# Altium schematic sheet Sheet3.SchDoc
size A; SheetNumber: 1; SheetTotal: 1
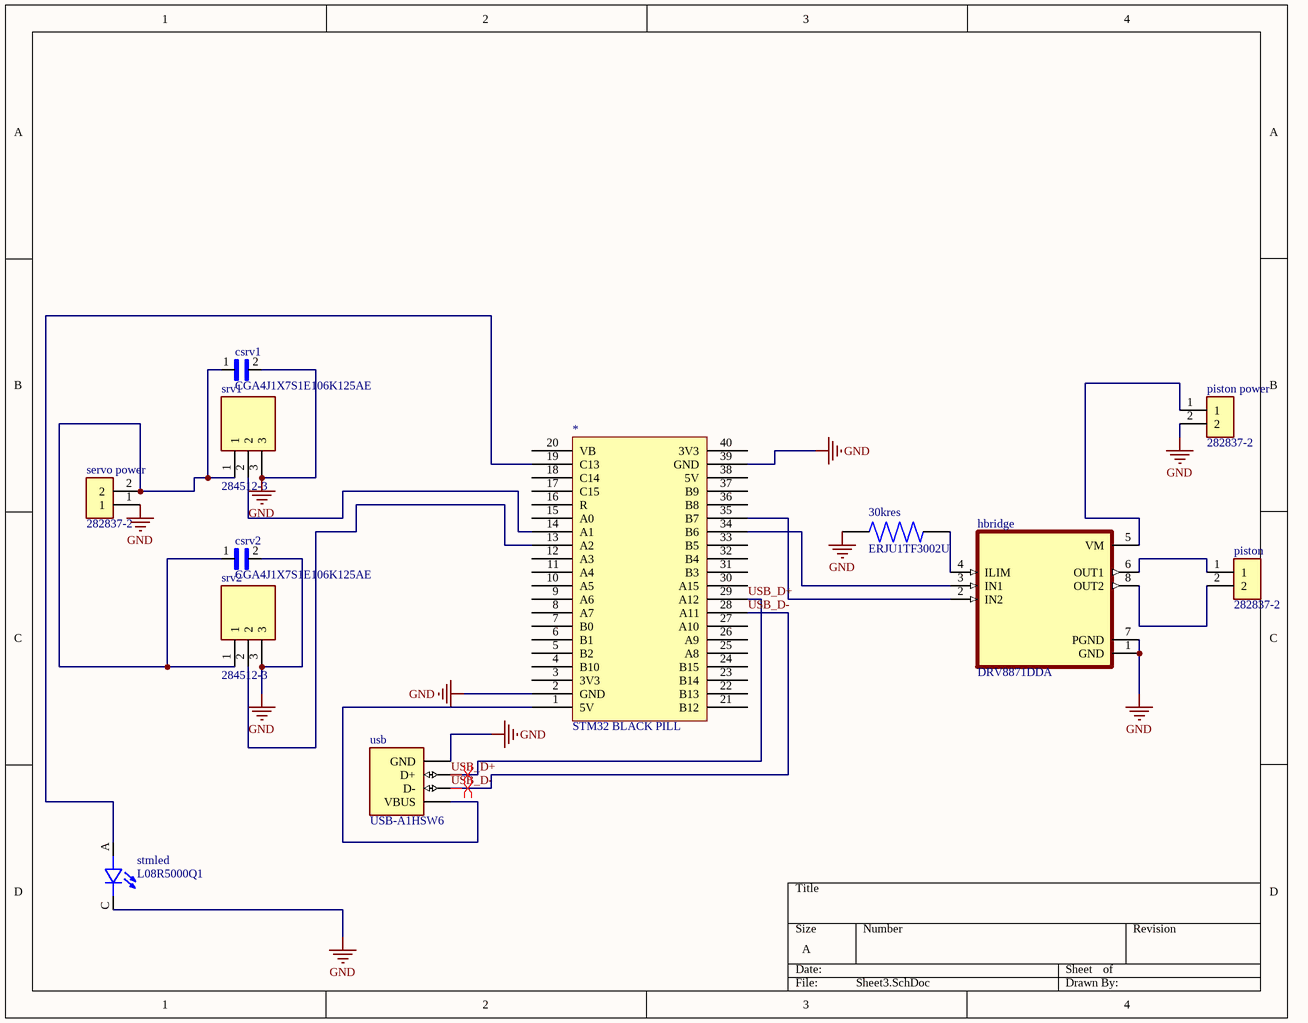
[diagram p0: Sheet3.SchDoc]

## Parts
30kres  ERJU1TF3002U  [RES_ERJU1TF3002U]
*  STM32 BLACK PILL  [STM 32 Black Pill]
csrv1  CGA4J1X7S1E106K125AE  [CAPC2012X150N]
csrv2  CGA4J1X7S1E106K125AE  [CAPC2012X150N]
hbridge  DRV8871DDA  [VREG_LM5017MR/NOPB]
piston  282837-2  [TE_282837-2]
piston_power  282837-2  [TE_282837-2]
servo_power  282837-2  [TE_282837-2]
srv1  284512-3  [TE_284512-3]
srv2  284512-3  [TE_284512-3]
stmled  L08R5000Q1  [LEDRD254W57D500H1070]
usb  USB-A1HSW6  [OST_USB-A1HSW6]

## Nets
GND: 30kres.1 *.2(GND) *.39(GND) csrv1.2 csrv2.2 hbridge.1(GND) hbridge.7(PGND) piston_power.2 servo_power.1 srv1.3 srv2.3 stmled.C usb.4(GND)
USB_D+: *.29(A12) usb.3(D+)
USB_D-: *.28(A11) usb.2(D-)
Net30kres_2: 30kres.2 hbridge.4(ILIM)
Net*_1: *.1(5V) usb.1(VBUS)
Net*_13: *.13(A2) srv2.2
Net*_14: *.14(A1) srv1.2
Net*_19: *.19(C13) stmled.A
Net*_34: *.34(B6) hbridge.3(IN1)
Net*_35: *.35(B7) hbridge.2(IN2)
Netcsrv1_1: csrv1.1 csrv2.1 servo_power.2 srv1.1 srv2.1
Nethbridge_5: hbridge.5(VM) piston_power.1
Nethbridge_6: hbridge.6(OUT1) piston.1
Nethbridge_8: hbridge.8(OUT2) piston.2

Not connected (* = marked no-connect by the designer): * 3(3V3) 4(B10) 5(B2) 6(B1) 7(B0) 8(A7) 9(A6) 10(A5) 11(A4) 12(A3) 15(A0) 16(R) 17(C15) 18(C14) 20(VB) 21(B12) 22(B13) 23(B14) 24(B15) 25(A8) 26(A9) 27(A10) 30(A15) 31(B3) 32(B4) 33(B5) 36(B8) 37(B9) 38(5V) 40(3V3)

## Layout directives
differential pair: USB_D+, USB_D-

## Library data of the parts
* = CMP-004-000000-1: Design Item ID: STM32 BLACK PILL; Source: STM 32 Balck Pill.SchLib
csrv1 csrv2 = CGA4J1X7S1E106K125AE: 10 ÂµF Â±10% 25V Ceramic Capacitor X7S 0805 (2012 Metric); MF: TDK; Value: *; Package: 2012 TDK; Check_prices: https://www.snapeda.com/parts/CGA4J1X7S1E106K125AE/TDK/view-part/?ref=eda; Digi-Key_Part_Number: 445-181411-2-ND; Purchase-URL: https://pricing.snapeda.com/search/part/CGA4J1X7S1E106K125AE/?ref=eda; SnapEDA_Link: https://www.snapeda.com/parts/CGA4J1X7S1E106K125AE/TDK/view-part/?ref=snap; MP: CGA4J1X7S1E106K125AE
hbridge = DRV8871DDA: 50-V, 3.6-A H-bridge motor driver with integrated current sensing; MF: Texas Instruments; SnapEDA_Link: https://www.snapeda.com/parts/DRV8871DDA/Texas+Instruments/view-part/?ref=snap; Package: HSOIC-8 Texas Instruments; Value: *; MP: DRV8871DDA; Check_prices: https://www.snapeda.com/parts/DRV8871DDA/Texas+Instruments/view-part/?ref=eda
piston piston_power servo_power = 282837-2: Ð Ð°Ð·ÑŠÐµÐ¼Ð½Ñ‹Ðµ ÐºÐ»ÐµÐ¼Ð¼Ð½Ñ‹Ðµ ÐºÐ¾Ð»Ð¾Ð´ÐºÐ¸ Ð Ð¾Ð·ÐµÑ‚ÐºÐ° 2 Ð¿Ð¾Ð»Ð¾Ð¶ÐµÐ½Ð¸Ñ 5,08 Ð¼Ð¼ ÐŸÑ€Ð¸Ð¿Ð¾Ð¹ Ð¿Ñ€ÑÐ¼Ð¾Ð¹ Ñ‡ÐµÑ€ÐµÐ· Ð¾Ñ‚Ð²ÐµÑ€ÑÑ‚Ð¸Ðµ 13,5 Ð / ÐºÐ¾Ð½Ñ‚Ð°ÐºÑ‚; MF: TE Connectivity; SnapEDA_Link: https://www.snapeda.com/parts/282837-2/TE+Connectivity+AMP+Connectors/view-part/?ref=snap; Price: None; Check_prices: https://www.snapeda.com/parts/282837-2/TE+Connectivity+AMP+Connectors/view-part/?ref=eda; Purchase-URL: https://pricing.snapeda.com/search/part/282837-2/?ref=eda; MP: 282837-2; Value: *; Availability: In Stock; Package: None
srv1 srv2 = 284512-3: 3 Position Terminal Block Header, Male Pins, Shrouded (4 Side) 0.138 (3.50mm) 90Â°, Right Angle Through Hole; Number_of_Positions: 3; MF: TE Connectivity; Centerline_Pitch: 3.5 mm[.138 in]; SnapEDA_Link: https://www.snapeda.com/parts/284512-3/TE+Connectivity+AMP+Connectors/view-part/?ref=snap; Package: None; Value: *; MP: 284512-3; EU_RoHS_Compliance: Compliant; Check_prices: https://www.snapeda.com/parts/284512-3/TE+Connectivity+AMP+Connectors/view-part/?ref=eda
stmled = L08R5000Q1: LED, 5MM, ORANGE; LED / Lamp Size: 5mm / T-1 3/4; LED Colour: Orange; Typ Luminous Intensity: 4.3mcd; Viewing Angle: ...; MF: LED Technology; Value: *; SnapEDA_Link: https://www.snapeda.com/parts/L08R5000Q1/LED+Technology/view-part/?ref=snap; MP: L08R5000Q1; Check_prices: https://www.snapeda.com/parts/L08R5000Q1/LED+Technology/view-part/?ref=eda; Availability: In Stock; Price: None; Package: None
usb = USB-A1HSW6: MF: {'manufacturer': u'On Shore Technology Inc.'}; Package: None; Price: None; Value: *; MP: USB-A1HSW6; Availability: Unavailable
30kres = ERJU1TF3002U: Value: *; Package: None; MP: ERJU1TF3002U; Price: None; Availability: Unavailable